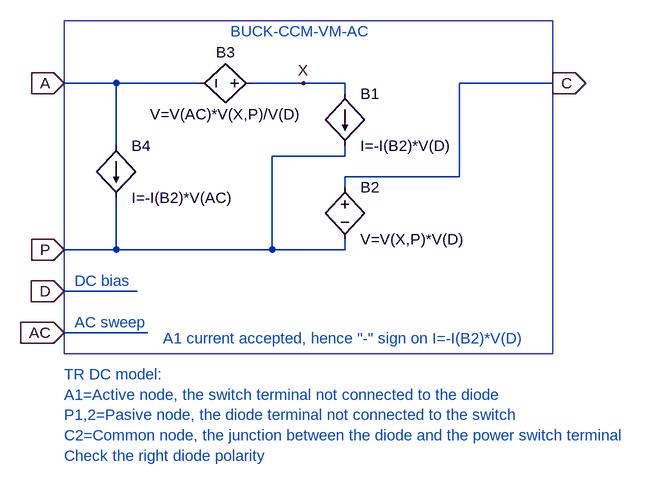
[diagram p0: schematic BUCK-CCM-VM-AC.asc]
BUCK-CCM-VM-AC.asc, the LTspice schematic file:
Version 4
SHEET 1 928 680
WIRE 32 -112 -48 -112
WIRE 160 -112 32 -112
WIRE 320 -112 240 -112
WIRE 384 -112 320 -112
WIRE 704 -112 560 -112
WIRE 384 -96 384 -112
WIRE 32 -16 32 -112
WIRE 384 0 384 -16
WIRE 384 0 272 0
WIRE 560 32 560 -112
WIRE 560 32 384 32
WIRE 384 48 384 32
WIRE 32 144 32 64
WIRE 32 144 -48 144
WIRE 272 144 272 0
WIRE 272 144 32 144
WIRE 384 144 384 128
WIRE 384 144 272 144
WIRE 64 208 -48 208
WIRE 80 272 -48 272
FLAG -48 -112 A
IOPIN -48 -112 In
FLAG -48 144 P
IOPIN -48 144 In
FLAG 704 -112 C
IOPIN 704 -112 Out
FLAG -48 208 D
IOPIN -48 208 In
FLAG -48 272 AC
IOPIN -48 272 In
FLAG 320 -112 X
SYMBOL bi 384 -96 R0
SYMATTR InstName B1
SYMATTR Value I=-I(B2)*V(D)
SYMBOL bv 384 32 R0
SYMATTR InstName B2
SYMATTR Value V=V(X,P)*V(D)
SYMBOL bv 256 -112 R90
WINDOW 0 -32 56 VBottom 0
WINDOW 3 32 56 VTop 0
SYMATTR InstName B3
SYMATTR Value V=V(AC)*V(X,P)/V(D)
SYMBOL bi 32 -16 R0
SYMATTR InstName B4
SYMATTR Value I=-I(B2)*V(AC)
TEXT 208 -192 Left 0 ;BUCK-CCM-VM-AC
TEXT -48 336 Left 0 ;TR DC model:\nA1=Active node, the switch terminal not connected to the diode\nP1,2=Pasive node, the diode terminal not connected to the switch\nC2=Common node, the junction between the diode and the power switch terminal\nCheck the right diode polarity
TEXT 104 280 Left 0 ;A1 current accepted, hence "-" sign on I=-I(B2)*V(D)
TEXT -32 256 Left 0 ;AC sweep
TEXT -32 192 Left 0 ;DC bias
RECTANGLE Normal 704 304 -48 -208

The netlist it stands for:
* BUCK-CCM-VM-AC.asc
B1 X P I=-I(B2)*V(D)
B2 C P V=V(X,P)*V(D)
B3 X A V=V(AC)*V(X,P)/V(D)
B4 A P I=-I(B2)*V(AC)
* BUCK-CCM-VM-AC
* TR DC model:
* A1=Active node, the switch terminal not connected to the diode
* P1,2=Pasive node, the diode terminal not connected to the switch
* C2=Common node, the junction between the diode and the power switch terminal
* Check the right diode polarity
* A1 current accepted, hence "-" sign on I=-I(B2)*V(D)
* AC sweep
* DC bias
.backanno
.end